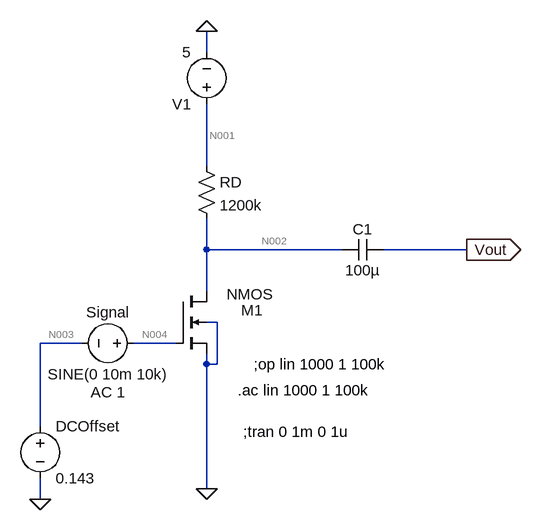
[diagram p0: schematic RD.asc]
RD.asc, the LTspice schematic file:
Version 4
SHEET 1 880 680
WIRE 224 -192 224 -224
WIRE 224 -16 224 -112
WIRE 224 112 224 64
WIRE 432 112 224 112
WIRE 624 112 496 112
WIRE 224 176 224 112
WIRE 240 224 224 224
WIRE 32 256 -32 256
WIRE 176 256 112 256
WIRE 224 288 224 272
WIRE 240 288 240 224
WIRE 240 288 224 288
WIRE -32 384 -32 256
WIRE 224 480 224 288
WIRE -32 496 -32 464
FLAG 224 -224 0
FLAG -32 496 0
FLAG 624 112 Vout
IOPIN 624 112 Out
FLAG 224 480 0
SYMBOL res 208 -32 R0
SYMATTR InstName RD
SYMATTR Value 1200k
SYMBOL nmos4 176 176 R0
WINDOW 0 101 29 Left 2
WINDOW 3 79 5 Left 2
SYMATTR InstName M1
SYMATTR Value2 l=0.18u w=1.8u
SYMBOL voltage 224 -96 R180
WINDOW 123 0 0 Left 0
WINDOW 39 0 0 Left 0
SYMATTR InstName V1
SYMATTR Value 5
SYMBOL voltage -32 368 R0
WINDOW 123 0 0 Left 0
WINDOW 39 0 0 Left 0
SYMATTR InstName DCOffset
SYMATTR Value 0.143
SYMBOL voltage 128 256 R90
WINDOW 0 -32 56 VBottom 2
WINDOW 3 32 56 VTop 2
WINDOW 123 60 56 VTop 2
WINDOW 39 0 0 Left 0
SYMATTR InstName Signal
SYMATTR Value SINE(0 10m 10k)
SYMATTR Value2 AC 1
SYMBOL cap 496 96 R90
WINDOW 0 0 32 VBottom 2
WINDOW 3 32 32 VTop 2
SYMATTR InstName C1
SYMATTR Value 100µ
TEXT 272 328 Left 2 !.ac lin 1000 1 100k
TEXT 280 392 Left 2 !;tran 0 1m 0 1u
TEXT 296 288 Left 2 !;op lin 1000 1 100k

The netlist it stands for:
* RD.asc
RD N001 N002 1200k
M1 N002 N004 0 0 NMOS l=0.18u w=1.8u
V1 N001 0 5
V§DCOffset N003 0 0.143
V§Signal N004 N003 SINE(0 10m 10k) AC 1
C1 Vout N002 100µ
.model NMOS NMOS
.model PMOS PMOS
.lib standard.mos
.ac lin 1000 1 100k
;tran 0 1m 0 1u
;op lin 1000 1 100k
.backanno
.end

* Results of the author's LTspice run, read from the files saved beside the schematic
* Operating Point, zero values left out:
*   V(n001) = 5 V
*   V(n002) = 2.546 V
*   V(n004) = 143 mV
*   V(n003) = 143 mV
*   V(vout) = 254.6 µV
*   Id(M1) = 2.045 µA
*   Ib(M1) = -2.556 pA
*   Is(M1) = -2.045 µA
*   I(Rd) = 2.045 µA
*   I(V1) = -2.045 µA